# Altium schematic sheet Alimentation.SchDoc: Alimentation 24V vers 3V3
size A4; Author: Xavier Hueber; Engineer: Xavier Hueber; Organization: Altium Limited; Address1: Laboratoire de Systèmes Embarqués; Address2: 7, rue de la Serre; Address3: 2610 Saint-Imier / Switzerland; Revision: 1; SheetNumber: 1; SheetTotal: 4
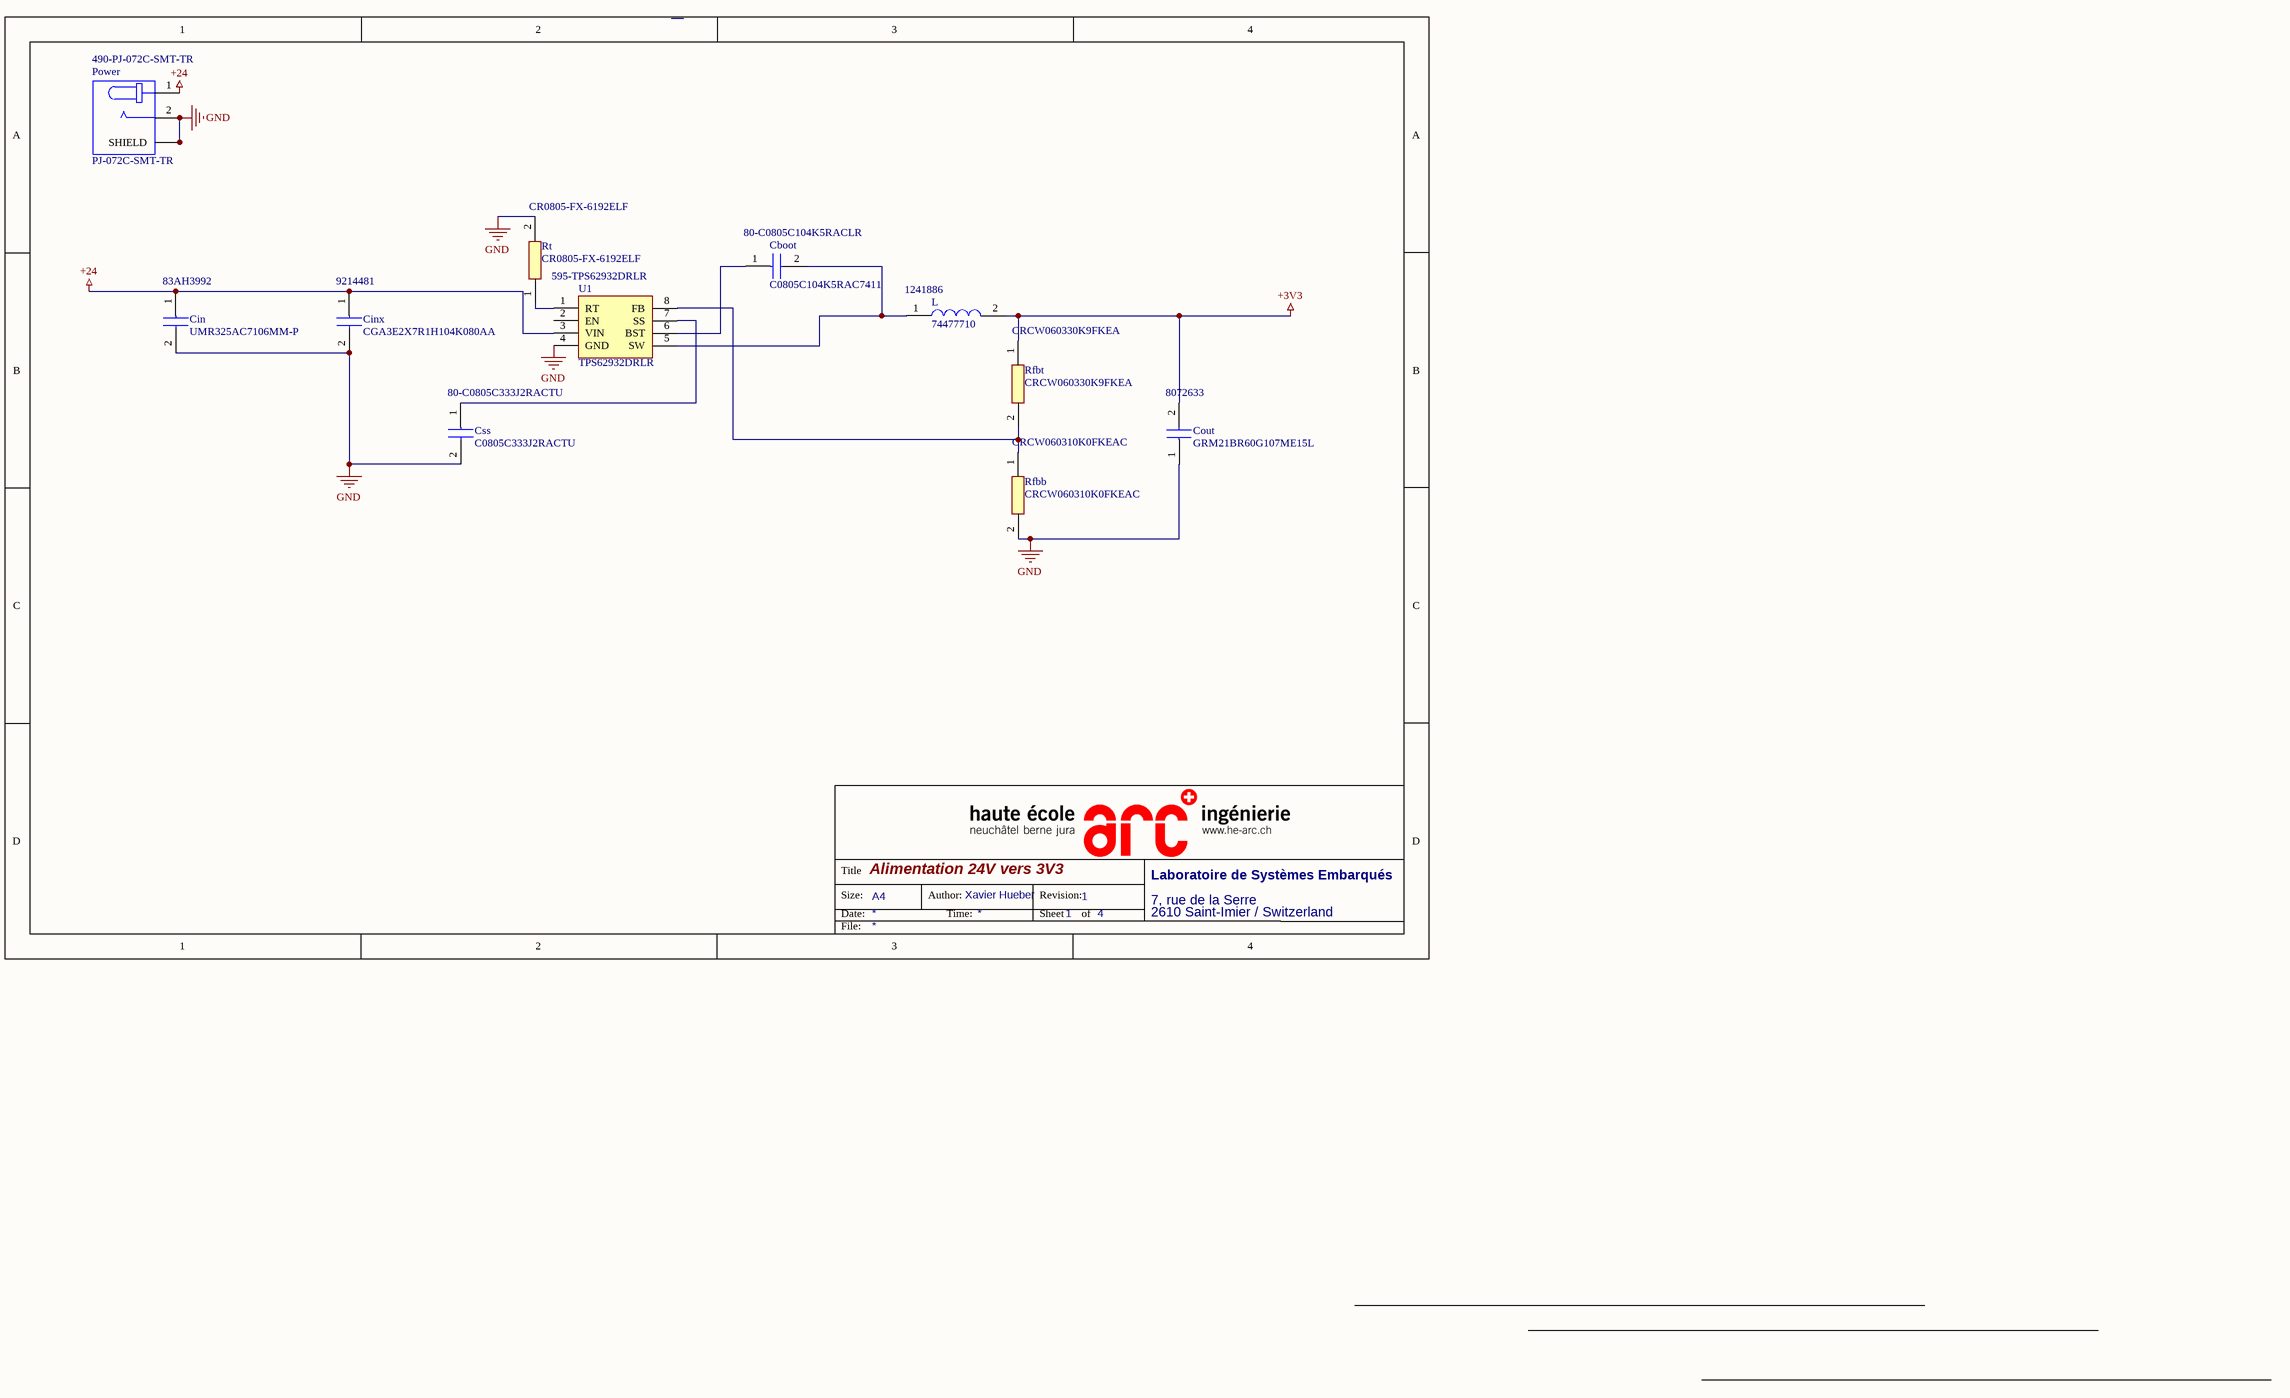
[diagram p0: Alimentation.SchDoc]

## Parts
Cboot  C0805C104K5RAC7411  Supplier Part Number 1: 80-C0805C104K5RACLR  [CAPC2012X88N]
Cin  UMR325AC7106MM-P  Supplier Part Number 1: 83AH3992  [CAPC3225X280N]
Cinx  CGA3E2X7R1H104K080AA  Supplier Part Number 1: 9214481  [CAPC1608X90N]
Cout  GRM21BR60G107ME15L  Supplier Part Number 1: 8072633  [CAPC2012X145N]
Css  C0805C333J2RACTU  Supplier Part Number 1: 80-C0805C333J2RACTU  [C0805]
L  74477710  Supplier Part Number 1: 1241886  [74477710]
Power  PJ-072C-SMT-TR  Supplier Part Number 1: 490-PJ-072C-SMT-TR  [PJ-072C-SMT-TR]
Rfbb  CRCW060310K0FKEAC  [RESC1608X55N]
Rfbt  CRCW060330K9FKEA  [RESC1608X50N]
Rt  CR0805-FX-6192ELF  [RESC2012X60N]
U1  TPS62932DRLR  Supplier Part Number 1: 595-TPS62932DRLR  [TPS62932DRLR]

## Nets
+3V3: Cout.2 L.2 Rfbt.1
+24: Cin.1 Cinx.1 Power.1 U1.3(VIN)
GND: Cin.2 Cinx.2 Cout.1 Css.2 Power.2 Power.3(SHIELD) Power.4(SHIELD) Rfbb.2 Rt.2 U1.4(GND)
NetCboot_1: Cboot.1 U1.6(BST)
NetCboot_2: Cboot.2 L.1 U1.5(SW)
NetCss_1: Css.1 U1.7(SS)
NetRfbb_1: Rfbb.1 Rfbt.2 U1.8(FB)
NetRt_1: Rt.1 U1.1(RT)

Not connected (* = marked no-connect by the designer): U1 2(EN)

## Notes on the sheet
- Title
- Size:
- Date:
- A4
- Author:
- Time:
- Revision:
- Sheet
- of
- File:

## Library data of the parts
Cboot = C0805C104K5RAC7411: Multilayer Ceramic Capacitors MLCC - SMD/SMT 50V 0.1uF X7R 0805 10%; Manufacturer_Name: KEMET; Datasheet Link: https://componentsearchengine.com//C0805C104K5RAC7411.pdf; Height: 0.88mm; Mouser2 Part Number: 80-C0805C104K5RACLR; Mouser2 Price/Stock: https://www.mouser.com/Search/Refine.aspx?Keyword=80-C0805C104K5RACLR; Manufacturer_Part_Number: C0805C104K5RAC7411; Supplier 1: Mouser
Cin = UMR325AC7106MM-P: Capacitor 1210 50V 10uF +-20%; Manufacturer_Name: TAIYO YUDEN; Height: 2.8mm; Manufacturer_Part_Number: UMR325AC7106MM-P; Supplier 1: Newark
Cinx = CGA3E2X7R1H104K080AA: Capacitor 0603 100nF; Manufacturer_Name: TDK; Datasheet Link: https://componentsearchengine.com//CGA3E2X7R1H104K080AA.pdf; Height: 0.9mm; Mouser2 Part Number: 810-CGA3E2X7R1H104K; Mouser2 Price/Stock: https://www.mouser.com/Search/Refine.aspx?Keyword=810-CGA3E2X7R1H104K; Manufacturer_Part_Number: CGA3E2X7R1H104K080AA; Supplier 1: RSComponents
Cout = GRM21BR60G107ME15L: 0805 100 uF 4 V ±20% Tolerance X5R Multilayer Ceramic Chip Capacitor; Manufacturer_Name: Murata Electronics; Datasheet Link: https://datasheet.datasheetarchive.com/originals/distributors/DKDS-10/192999.pdf; Height: 1.45mm; Manufacturer_Part_Number: GRM21BR60G107ME15L; Supplier 1: Future Electronics
Css = C0805C333J2RACTU: Multilayer Ceramic Capacitors MLCC - SMD/SMT 200V 0.033uF X7R 0805 5%; Manufacturer_Name: KEMET; Datasheet Link: https://content.kemet.com/datasheets/KEM_C1002_X7R_SMD.pdf; Height: 1.1mm; Manufacturer_Part_Number: C0805C333J2RACTU; Supplier 1: Mouser
Power = PJ-072C-SMT-TR: 1.0 x 3.6 mm, 2.0 A, Horizontal, Surface Mount (SMT), Shielded, Dc Power Jack Connector; Supplier 1: Mouser
Rfbb = CRCW060310K0FKEAC: Res Thick Film 0603 10K Ohm 1% 1/10W ±100ppm/°C Molded SMD Paper T/R; Manufacturer_Name: Vishay; Datasheet Link: https://componentsearchengine.com//CRCW060310K0FKEAC.pdf; Height: 0.55mm; Mouser2 Part Number: 71-CRCW060310K0FKEAC; Mouser2 Price/Stock: https://www.mouser.com/Search/Refine.aspx?Keyword=71-CRCW060310K0FKEAC; Manufacturer_Part_Number: CRCW060310K0FKEAC; Supplier 1: Arrow Electronics; Supplier Part Number 1: CRCW060310K0FKEAC
Rfbt = CRCW060330K9FKEA: Res Thick Film 0603 30.9K Ohm 1% 1/10W ±100ppm/°C Molded SMD SMD Paper T/R; Manufacturer_Name: Vishay; Datasheet Link: http://www.vishay.com/docs/20035/dcrcwe3.pdf; Height: 0.5mm; Manufacturer_Part_Number: CRCW060330K9FKEA; Supplier 1: Arrow Electronics; Supplier Part Number 1: CRCW060330K9FKEA
Rt = CR0805-FX-6192ELF: Resistor 0805 61.9kOhm; Manufacturer_Name: Bourns; Datasheet Link: https://www.bourns.com/pdfs/chpreztr.pdf; Height: 0.6mm; Manufacturer_Part_Number: CR0805-FX-6192ELF; Supplier 1: Avnet; Supplier Part Number 1: CR0805-FX-6192ELF
U1 = TPS62932DRLR: 3.8-V to 30-V input, 2-A, 200-kHz to 2.2-MHz, low-IQ synchronous buck converter in SOT-583 package; Manufacturer_Name: Texas Instruments; Datasheet Link: https://www.ti.com/lit/gpn/tps62932; Height: 0.6mm; Manufacturer_Part_Number: TPS62932DRLR; Supplier 1: Mouser
L = 74477710: Supplier 1: RSComponents